# EAGLE design Input_Mode_Shield (EAGLE 5.06)
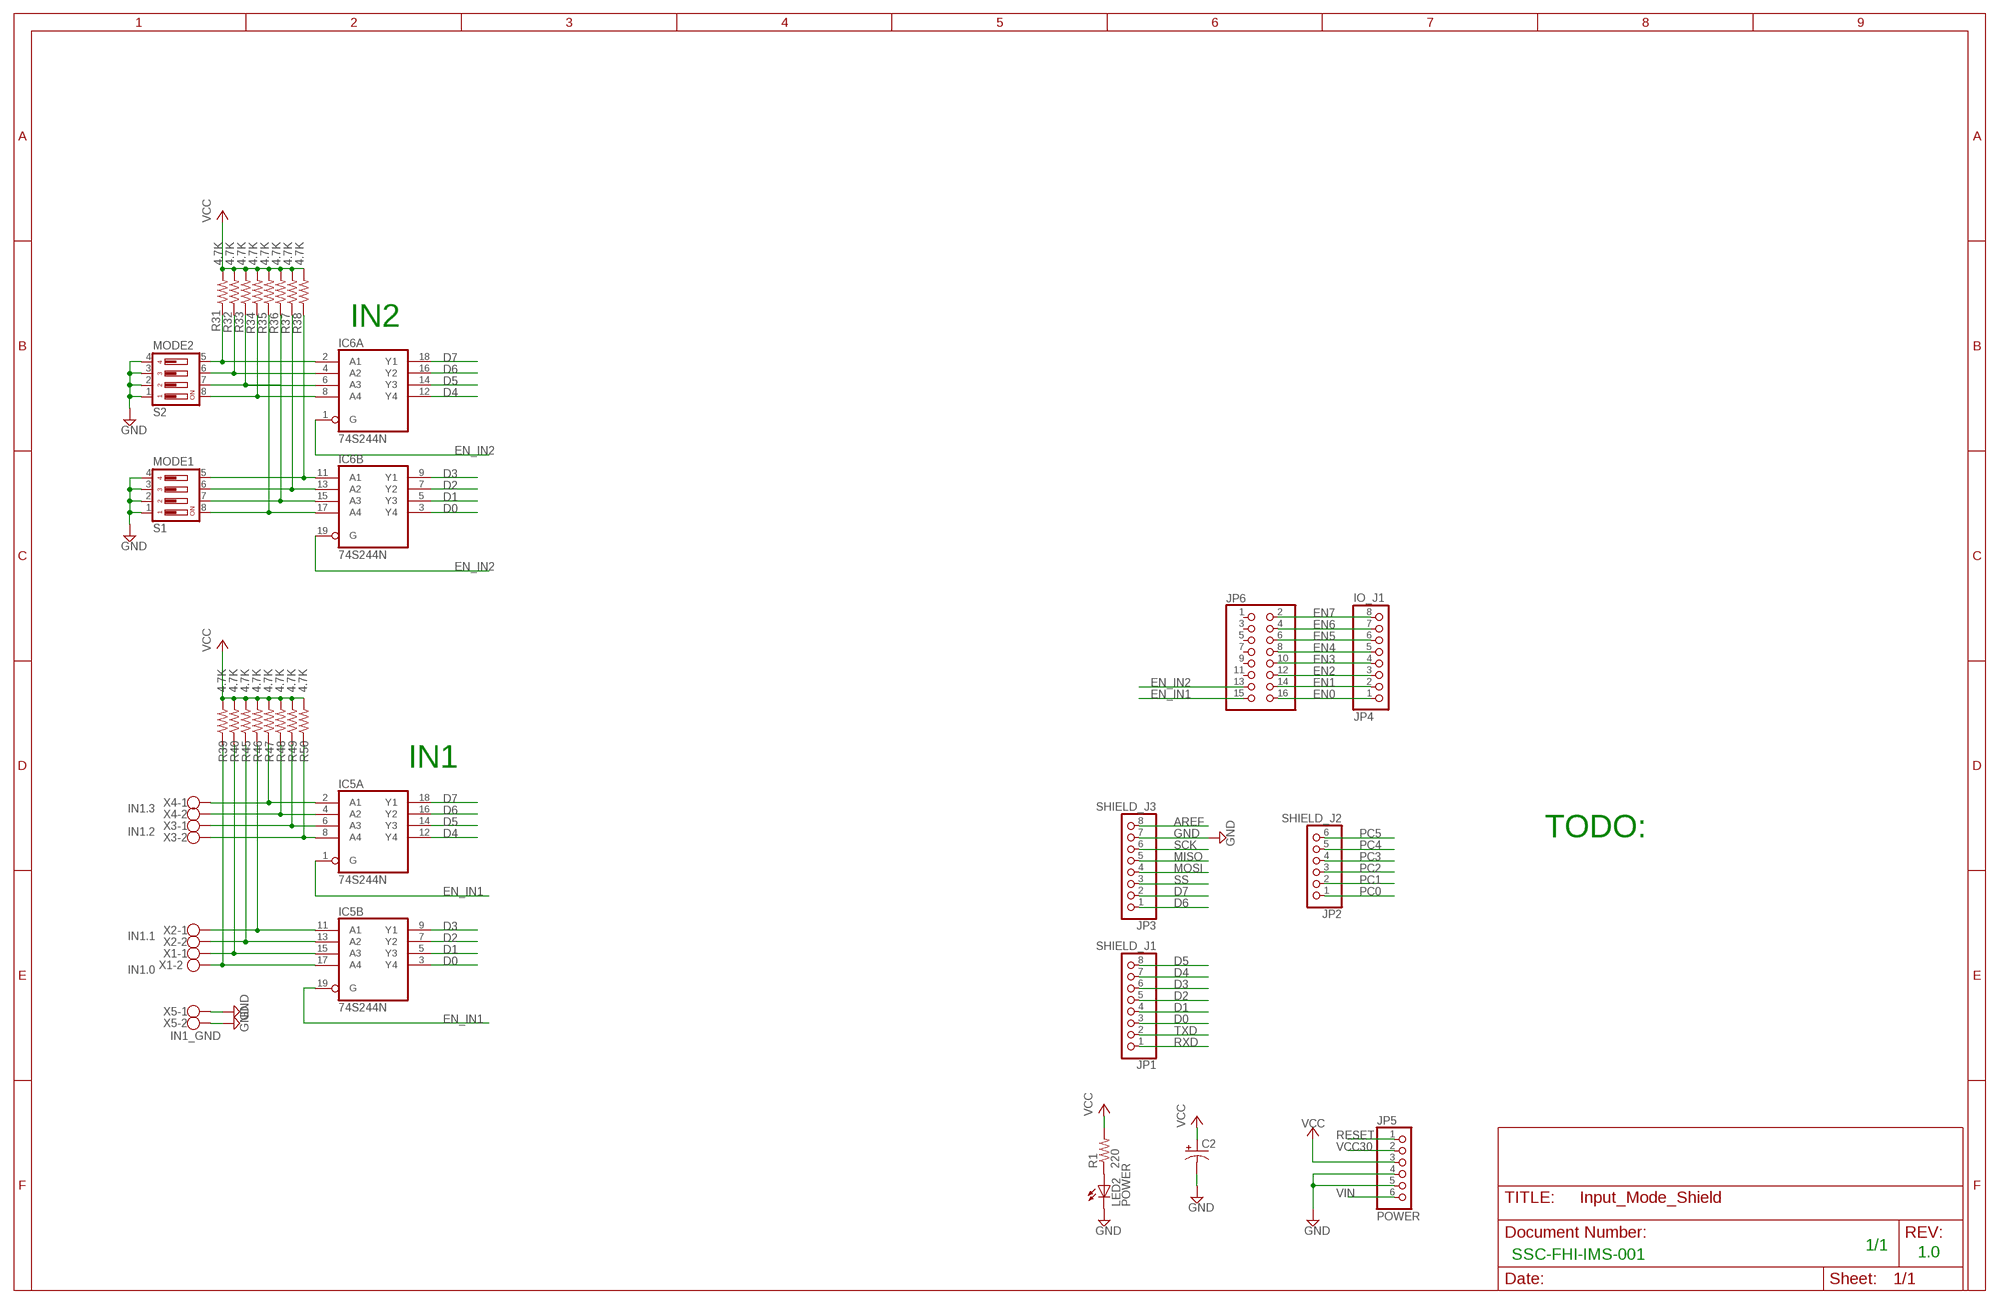
[diagram p0: schematic, sheet 1]

## Parts
C2  CPOL-USE2.5-5  [E2,5-5]
IC5  74S244N  [DIL20]
IC6  74S244N  [DIL20]
JP1  SHIELD_J1  PINHD-1X8  [1X08]
JP2  SHIELD_J2  PINHD-1X6  [1X06]
JP3  SHIELD_J3  PINHD-1X8  [1X08]
JP4  IO_J1  PINHD-1X8  [1X08]
JP5  POWER  PINHD-1X6  [1X06]
JP6  PINHD-2X8  [2X08]
LED2  POWER  LED5MM  [LED5MM]
R1  220  R-US_0204/7  [0204/7]
R31  4.7K  R-US_0207/2V  [0207/2V]
R32  4.7K  R-US_0207/2V  [0207/2V]
R33  4.7K  R-US_0207/2V  [0207/2V]
R34  4.7K  R-US_0207/2V  [0207/2V]
R35  4.7K  R-US_0207/2V  [0207/2V]
R36  4.7K  R-US_0207/2V  [0207/2V]
R37  4.7K  R-US_0207/2V  [0207/2V]
R38  4.7K  R-US_0207/2V  [0207/2V]
R39  4.7K  R-US_0207/2V  [0207/2V]
R40  4.7K  R-US_0207/2V  [0207/2V]
R45  4.7K  R-US_0207/2V  [0207/2V]
R46  4.7K  R-US_0207/2V  [0207/2V]
R47  4.7K  R-US_0207/2V  [0207/2V]
R48  4.7K  R-US_0207/2V  [0207/2V]
R49  4.7K  R-US_0207/2V  [0207/2V]
R50  4.7K  R-US_0207/2V  [0207/2V]
S1  MODE1  DS04  [DS-04]
S2  MODE2  DS04  [DS-04]
X1  IN1.0  AK550/2  [AK550/2]
X2  IN1.1  AK550/2  [AK550/2]
X3  IN1.2  AK550/2  [AK550/2]
X4  IN1.3  AK550/2  [AK550/2]
X5  IN1_GND  AK550/2  [AK550/2]

## Nets
AREF: JP3.8
D0: IC5.3(B:Y4) IC6.3(B:Y4) JP1.3
D1: IC5.5(B:Y3) IC6.5(B:Y3) JP1.4
D2: IC5.7(B:Y2) IC6.7(B:Y2) JP1.5
D3: IC5.9(B:Y1) IC6.9(B:Y1) JP1.6
D4: IC5.12(A:Y4) IC6.12(A:Y4) JP1.7
D5: IC5.14(A:Y3) IC6.14(A:Y3) JP1.8
D6: IC5.16(A:Y2) IC6.16(A:Y2) JP3.1
D7: IC5.18(A:Y1) IC6.18(A:Y1) JP3.2
EN0: JP4.1 JP6.16
EN1: JP4.2 JP6.14
EN2: JP4.3 JP6.12
EN3: JP4.4 JP6.10
EN4: JP4.5 JP6.8
EN5: JP4.6 JP6.6
EN6: JP4.7 JP6.4
EN7: JP4.8 JP6.2
EN_IN1: IC5.1(A:G) IC5.19(B:G) JP6.15
EN_IN2: IC6.1(A:G) IC6.19(B:G) JP6.13
GND: C2.- JP3.7 JP5.4 JP5.5 LED2.K(C) S1.1 S1.2 S1.3 S1.4 S2.1 S2.2 S2.3 S2.4 X5.1 X5.2
IN1: IC5.17(B:A4) R39.1 X1.2
IN2: IC5.15(B:A3) R40.1 X1.1
IN3: IC5.13(B:A2) R45.1 X2.2
IN4: IC5.11(B:A1) R46.1 X2.1
IN5: IC5.8(A:A4) R50.1 X3.2
IN6: IC5.6(A:A3) R49.1 X3.1
IN7: IC5.4(A:A2) R48.1 X4.2
IN8: IC5.2(A:A1) R47.1 X4.1
IN9: IC6.17(B:A4) R35.1 S1.8
IN10: IC6.15(B:A3) R36.1 S1.7
IN11: IC6.13(B:A2) R37.1 S1.6
IN12: IC6.11(B:A1) R38.1 S1.5
IN13: IC6.8(A:A4) R34.1 S2.8
IN14: IC6.6(A:A3) R33.1 S2.7
IN15: IC6.4(A:A2) R32.1 S2.6
IN16: IC6.2(A:A1) R31.1 S2.5
MISO: JP3.5
MOSI: JP3.4
N$1: LED2.A R1.1
PC0: JP2.1
PC1: JP2.2
PC2: JP2.3
PC3: JP2.4
PC4: JP2.5
PC5: JP2.6
RESET: JP5.1
RXD: JP1.1
SCK: JP3.6
SS: JP3.3
TXD: JP1.2
VCC: C2.+ JP5.3 R1.2 R31.2 R32.2 R33.2 R34.2 R35.2 R36.2 R37.2 R38.2 R39.2 R40.2 R45.2 R46.2 R47.2 R48.2 R49.2 R50.2
VCC30: JP5.2
VIN: JP5.6
Unconnected: JP6.1 JP6.3 JP6.5 JP6.7 JP6.9 JP6.11

## Notes on the sheet
- IN2
- IN1
- TODO:
- 1/1
- SSC-FHI-IMS-001 | 1.0

## Power pins joined to a net without a drawn wire
GND: IC5.10(P:GND) IC6.10(P:GND)
VCC: IC5.20(P:VCC) IC6.20(P:VCC)

## Library data of the parts
C2 = rcl:CPOL-US: POLARIZED CAPACITOR, American symbol
IC5 IC6 = 74xx-us:74*244: Octal BUFFER and LINE DRIVER, 3-state
JP1 JP3 JP4 = pinhead:PINHD-1X8: PIN HEADER
JP2 JP5 = pinhead:PINHD-1X6: PIN HEADER
JP6 = pinhead:PINHD-2X8: PIN HEADER
LED2 = led:LED: LED OSRAM: - CHIPLED LG R971, LG N971, LY N971, LG Q971, LY Q971, LO R971, LY R971 LH N974, LH R974 LS Q976, LO Q976, LY Q976 LO Q996 - Hyper CHIPLED LW Q18S LB Q993, LB Q99A, LB R99A - SideLED LS A670, LO A670, LY A670, LG A670, LP A670 LB A673, LV A673, LT A673, LW A673 LH A674 LY A675 LS A676, LA A676, LO A676, LY A676, LW A676 LS A679, LY A679, LG A679 - Hyper Micro SIDELED® LS Y876, LA Y876, LO Y876, LY Y876 LT Y87S - SmartLED LW L88C, LW L88S LB L89C, LB L89S, LG L890 LS L89K, LO L89K, LY L89K LS L896, LA L896, LO L896, LY L896 - TOPLED LS T670, LO T670, LY T670, LG T670, LP T670 LSG T670, LSP T670, LSY T670, LOP T670, LYG T670 LG T671, LOG T671, LSG T671 LB T673, LV T673, LT T673, LW T673 LH T674 LS T676, LA T676, LO T676, LY T676, LB T676, LH T676, LSB T676, LW T676 LB T67C, LV T67C, LT T67C, LS T67K, LO T67K, LY T67K, LW E67C LS E67B, LA E67B, LO E67B, LY E67B, LB E67C, LV E67C, LT E67C LW T67C LS T679, LY T679, LG T679 LS T770, LO T770, LY T770, LG T770, LP T770 LB T773, LV T773, LT T773, LW T773 LH T774 LS E675, LA E675, LY E675, LS T675 LS T776, LA T776, LO T776, LY T776, LB T776 LHGB T686 LT T68C, LB T68C - Hyper Mini TOPLED® LB M676 - Mini TOPLED Santana® LG M470 LS M47K, LO M47K, LY M47K Source: http://www.osram.convergy.de - LUMILED® LXK2-PW12-R00, LXK2-PW12-S00, LXK2-PW14-U00, LXK2-PW14-V00 LXK2-PM12-R00, LXK2-PM12-S00, LXK2-PM14-U00 LXK2-PE12-Q00, LXK2-PE12-R00, LXK2-PE12-S00, LXK2-PE14-T00, LXK2-PE14-U00 LXK2-PB12-K00, LXK2-PB12-L00, LXK2-PB12-M00, LXK2-PB14-N00, LXK2-PB14-P00, LXK2-PB14-Q00 LXK2-PR12-L00, LXK2-PR12-M00, LXK2-PR14-Q00, LXK2-PR14-R00 LXK2-PD12-Q00, LXK2-PD12-R00, LXK2-PD12-S00 LXK2-PH12-R00, LXK2-PH12-S00 LXK2-PL12-P00, LXK2-PL12-Q00, LXK2-PL12-R00 Source: www.luxeon.com
R1 R31-R40 R45-R50 = resistor:R-US_: RESISTOR, American symbol
S1 S2 = switch-dil:DS04: DIL/CODE SWITCH
X1-X5 = con-ptr500+_v5:AK550/2: CONNECTOR

## Board
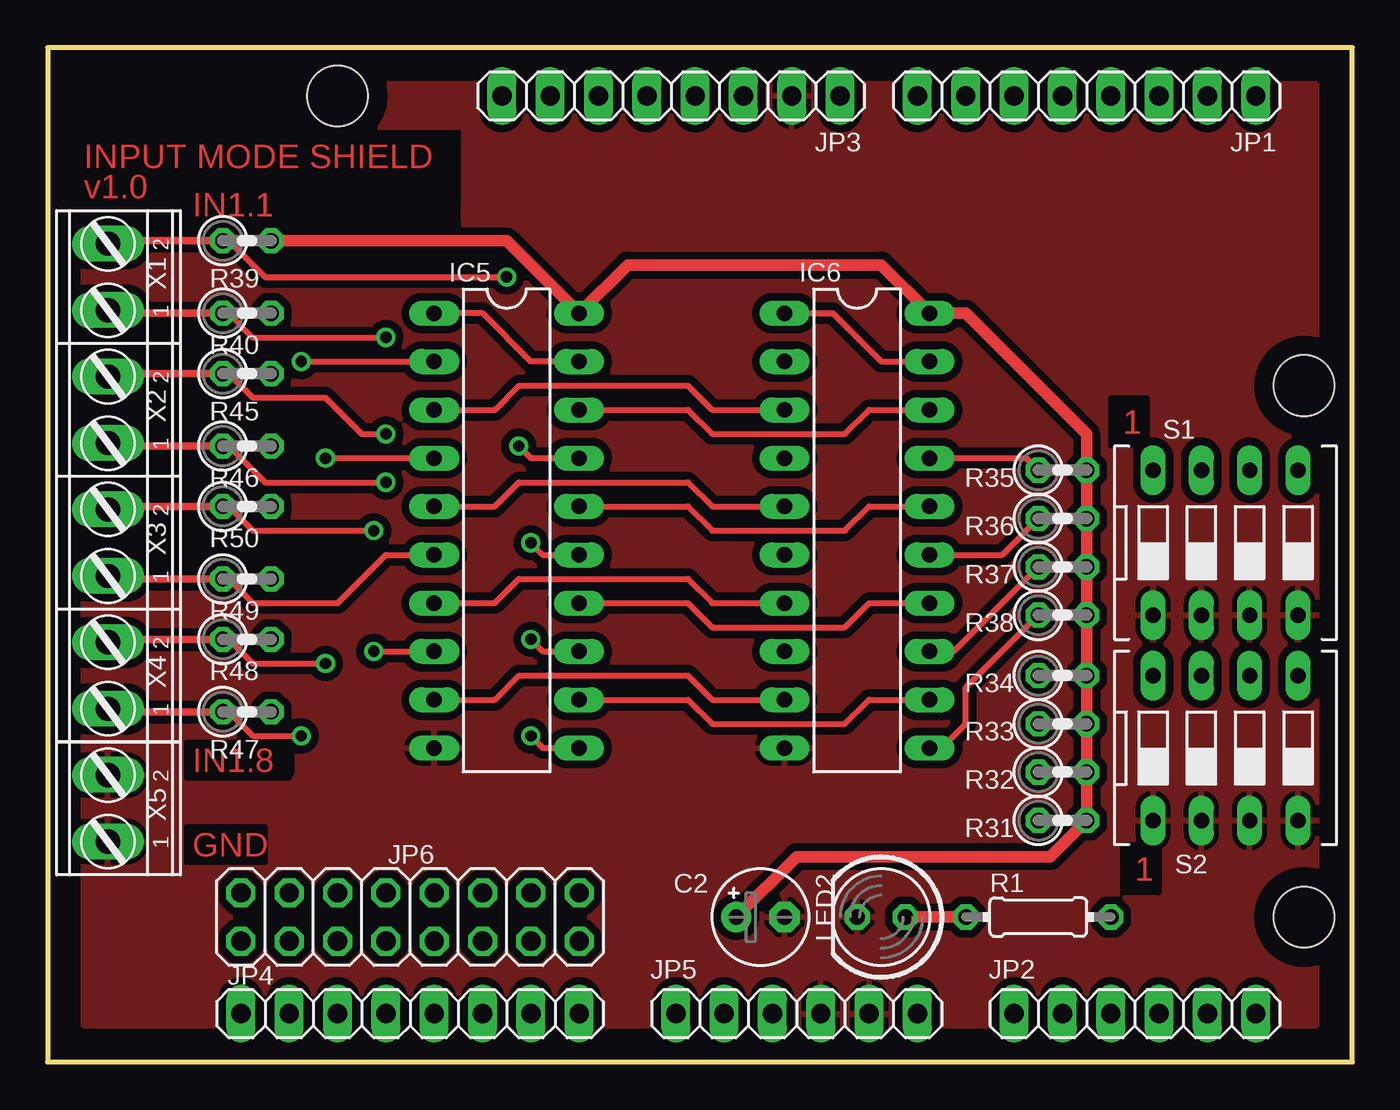
[diagram p1: board, top side]
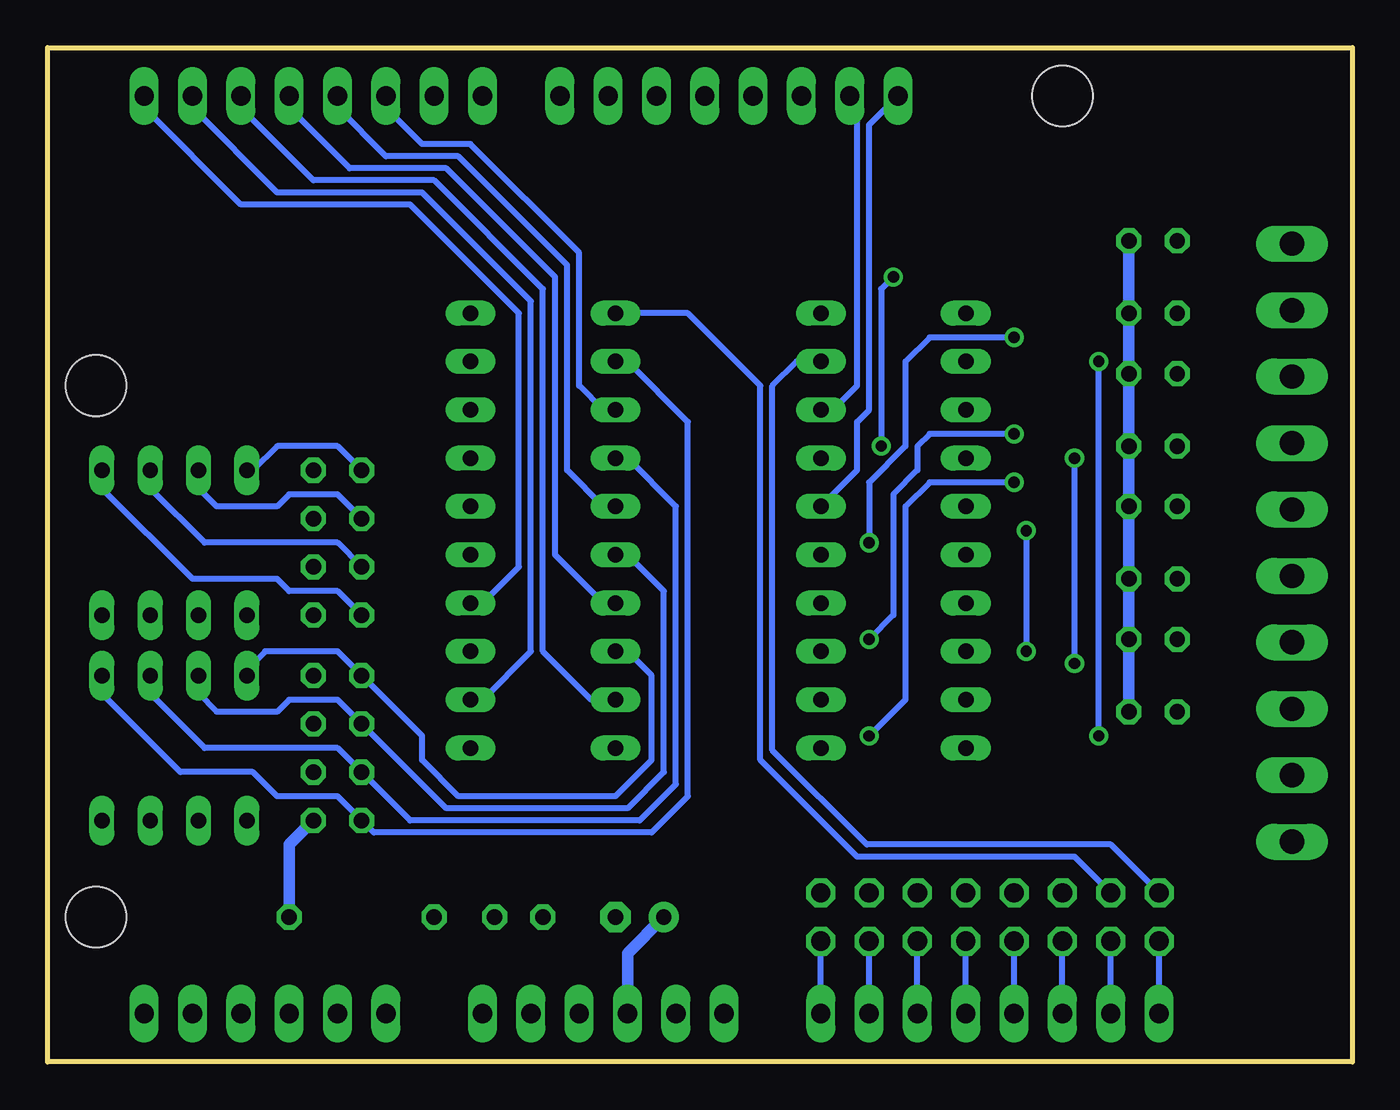
[diagram p2: board, bottom side, seen from below]

Size 68.58 x 53.34 mm. Coordinates in mm from the lower left corner, seen from the top.
Outline: 0,0 68.58,0 68.58,53.34 0,53.34 0,0
Copper layers (1*16): Top 0.035mm / dielectric 1.5mm / Bottom 0.035mm
Design rules "default *": minimum track width 8mil, minimum drill 20mil, track to track 16mil, track to pad 16mil, pad to pad 8mil, via to via 8mil, smd to smd 8mil, copper to edge 40mil, drill to drill 8mil, minimum pad ring 10mil, minimum via ring 8mil, stop-mask expansion 4mil, vias tented up to drill 0mil, thermal gap 10mil
Holes 3.2 mm at 15.24,50.8 66.04,35.56 66.04,7.62
tRestrict: area 1.3,45.1 to 21.6,48.9; area 55.9,32.4 to 57.8,34.9; area 56.5,8.9 to 58.4,11.4; area 7.3,14.9 to 12.7,16.8; area 7.3,10.5 to 11.4,12.4; area 7,44.1 to 21.6,46

### Footprints (pad centres in the part's own frame; a part is rotated, then mirrored left to right if it is on the bottom)
E2,5-5 = drill 0.813 pad 1.6 round: + -1.27,0 | drill 0.813 pad 1.6 octagon: - 1.27,0
DIL20 = drill 0.813 long: 1 -11.43,-3.81; 2 -8.89,-3.81; 3 -6.35,-3.81; 4 -3.81,-3.81; 5 -1.27,-3.81; 6 1.27,-3.81; 7 3.81,-3.81; 8 6.35,-3.81; 9 8.89,-3.81; 10 11.43,-3.81; 11 11.43,3.81; 12 8.89,3.81; 13 6.35,3.81; 14 3.81,3.81; 15 1.27,3.81; 16 -1.27,3.81; 17 -3.81,3.81; 18 -6.35,3.81; 19 -8.89,3.81; 20 -11.43,3.81
1X08 = drill 1.016 long: 1 -8.89,0; 2 -6.35,0; 3 -3.81,0; 4 -1.27,0; 5 1.27,0; 6 3.81,0; 7 6.35,0; 8 8.89,0
1X06 = drill 1.016 long: 1 -6.35,0; 2 -3.81,0; 3 -1.27,0; 4 1.27,0; 5 3.81,0; 6 6.35,0
2X08 = drill 1.016 octagon: 1 -8.89,-1.27; 2 -8.89,1.27; 3 -6.35,-1.27; 4 -6.35,1.27; 5 -3.81,-1.27; 6 -3.81,1.27; 7 -1.27,-1.27; 8 -1.27,1.27; 9 1.27,-1.27; 10 1.27,1.27; 11 3.81,-1.27; 12 3.81,1.27; 13 6.35,-1.27; 14 6.35,1.27; 15 8.89,-1.27; 16 8.89,1.27
LED5MM = drill 0.813 octagon: A -1.27,0; K 1.27,0
0204/7 = drill 0.813 octagon: 1 -3.81,0; 2 3.81,0
0207/2V = drill 0.813 octagon: 1 -1.27,0; 2 1.27,0
DS-04 = drill 0.813 long: 1 -3.81,-3.81; 2 -1.27,-3.81; 3 1.27,-3.81; 4 3.81,-3.81; 5 3.81,3.81; 6 1.27,3.81; 7 -1.27,3.81; 8 -3.81,3.81
AK550/2 = drill 1.27 long: 1 -1.75,0; 2 1.75,0

### Placement (x,y rotation side)
C2  37.47,7.62 0 top
IC5  24.13,27.94 270 top
IC6  42.55,27.94 270 top
JP1  54.61,50.8 0 top
JP2  57.15,2.54 0 top
JP3  32.77,50.8 0 top
JP4  19.05,2.54 0 top
JP5  39.37,2.54 0 top
JP6  19.05,7.62 180 top
LED2  43.81,7.62 180 top
R1  52.07,7.62 0 top
R31  53.34,12.7 0 top
R32  53.34,15.24 0 top
R33  53.34,17.78 0 top
R34  53.34,20.32 0 top
R35  53.34,31.11 0 top
R36  53.34,28.57 0 top
R37  53.34,26.04 0 top
R38  53.34,23.5 0 top
R39  10.48,43.18 0 top
R40  10.48,39.37 0 top
R45  10.48,36.2 0 top
R46  10.48,32.38 0 top
R47  10.48,18.41 0 top
R48  10.48,22.23 0 top
R49  10.48,25.4 0 top
R50  10.48,29.21 0 top
S1  61.91,27.3 0 top
S2  61.91,16.51 0 top
X1  3.17,41.27 90 top
X2  3.17,34.29 90 top
X3  3.17,27.3 90 top
X4  3.17,20.32 90 top
X5  3.17,13.34 90 top

### Tracks (layer width: path | path; a pad name or v marks a point on that pad's centre or on a via)
D0
  Top 0.305: IC5.3 23.5,34.29 24.77,35.56 33.66,35.56 34.92,34.29 IC6.3
  Bottom 0.305: IC6.3 39.37,34.29 40.64,35.56 40.64,42.55 46.35,48.26 48.9,48.26 50.8,50.16 JP1.3
D1
  Top 0.305: IC5.5 23.5,29.21 24.77,30.48 33.66,30.48 34.92,29.21 IC6.5
  Bottom 0.305: IC6.5 39.37,29.21 41.27,31.11 41.27,41.91 46.99,47.62 50.8,47.62 53.34,50.16 JP1.4
D2
  Top 0.305: IC5.7 23.5,24.13 24.77,25.4 33.66,25.4 34.92,24.13 IC6.7
  Bottom 0.305: IC6.7 39.37,24.13 41.91,26.67 41.91,41.27 47.62,46.99 52.7,46.99 55.88,50.16 JP1.5
D3
  Top 0.305: IC5.9 23.5,19.05 24.77,20.32 33.66,20.32 34.92,19.05 IC6.9
  Bottom 0.305: IC6.9 40.01,19.05 42.55,21.59 42.55,40.64 48.26,46.35 54.61,46.35 58.42,50.16 JP1.6
D4
  Top 0.305: IC5.12 33.66,19.05 34.92,17.78 41.91,17.78 43.18,19.05 IC6.12
  Bottom 0.305: IC6.12 45.72,19.05 43.18,21.59 43.18,40.01 48.9,45.72 56.52,45.72 60.96,50.16 JP1.7
D5
  Top 0.305: IC5.14 33.66,24.13 34.92,22.86 41.91,22.86 43.18,24.13 IC6.14
  Bottom 0.305: IC6.14 45.72,24.13 43.81,26.04 43.81,39.37 49.53,45.09 58.42,45.09 63.5,50.16 JP1.8
D6
  Top 0.305: IC6.16 43.18,29.21 41.91,27.94 34.92,27.94 33.66,29.21 IC5.16
  Bottom 0.305: JP3.1 25.4,49.28 25.4,34.29 26.04,33.66 26.04,31.11 IC5.16
D7
  Top 0.305: IC6.18 43.18,34.29 41.91,33.02 34.92,33.02 33.66,34.29 IC5.18
  Bottom 0.305: IC5.18 27.3,34.29 26.04,35.56 26.04,50.42 JP3.2
EN0
  Bottom 0.305: JP4.1 JP6.16
EN1
  Bottom 0.305: JP4.2 JP6.14
EN2
  Bottom 0.305: JP4.3 JP6.12
EN3
  Bottom 0.305: JP4.4 JP6.10
EN4
  Bottom 0.305: JP4.5 JP6.8
EN5
  Bottom 0.305: JP4.6 JP6.6
EN6
  Bottom 0.305: JP4.7 JP6.4
EN7
  Bottom 0.305: JP4.8 JP6.2
EN_IN1
  Top 0.305: IC5.19 25.4,36.83 22.86,39.37 IC5.1
  Bottom 0.305: IC5.19 29.21,36.83 30.48,35.56 30.48,16.39 25.52,11.43 12.7,11.43 JP6.15
EN_IN2
  Top 0.305: IC6.19 43.81,36.83 41.27,39.37 IC6.1
  Bottom 0.305: IC6.1 34.92,39.37 31.11,35.56 31.11,15.88 26.04,10.79 14.61,10.79 JP6.13
GND
  pour Top: 1.91,51.44 66.67,51.44 66.67,49.53 66.67,19.05 66.67,1.91 1.91,1.91 1.91,5.08
IN1  (via drill 0.6)
  Top 0.305: IC5.17 25.4,31.75 v24.77,32.38 | R39.1 9.53,43.18 11.43,41.27 v24.13,41.27
  Top 0.406: R39.1 3.33,43.18 X1.2
  Bottom 0.305: v24.13,41.27 24.77,40.64 v24.77,32.38
IN2  (via drill 0.6)
  Top 0.305: IC5.15 26.04,26.67 v25.4,27.3 | R40.1 9.53,39.37 10.79,38.1 v17.78,38.1
  Top 0.406: R40.1 3.33,39.37 X1.1
  Bottom 0.305: v17.78,38.1 22.23,38.1 23.5,36.83 23.5,32.38 25.4,30.48 v25.4,27.3
IN3  (via drill 0.6)
  Top 0.305: IC5.13 26.04,21.59 v25.4,22.23 | R45.1 9.53,36.2 10.79,34.92 14.61,34.92 16.51,33.02 v17.78,33.02
  Top 0.406: R45.1 3.33,36.2 X2.2
  Bottom 0.305: v17.78,33.02 22.23,33.02 22.86,32.38 22.86,31.11 24.13,29.84 24.13,23.5 v25.4,22.23
IN4  (via drill 0.6)
  Top 0.305: IC5.11 26.04,16.51 v25.4,17.14 | R46.1 9.53,32.38 11.43,30.48 v17.78,30.48
  Top 0.406: R46.1 3.33,32.38 X2.1
  Bottom 0.305: v17.78,30.48 22.23,30.48 23.5,29.21 23.5,19.05 v25.4,17.14
IN5  (via drill 0.6)
  Top 0.305: R50.1 9.53,29.21 10.79,27.94 v17.14,27.94 | v17.14,21.59 IC5.8
  Top 0.406: R50.1 3.33,29.21 X3.2
  Bottom 0.305: v17.14,27.94 v17.14,21.59
IN6
  Top 0.305: R49.1 9.53,25.4 10.79,24.13 15.24,24.13 17.78,26.67 IC5.6
  Top 0.406: R49.1 3.33,25.4 X3.1
IN7  (via drill 0.6)
  Top 0.305: R48.1 9.53,22.23 10.79,20.95 v14.61,20.95 | v14.61,31.75 IC5.4
  Top 0.406: R48.1 3.33,22.23 X4.2
  Bottom 0.305: v14.61,20.95 v14.61,31.75
IN8  (via drill 0.6)
  Top 0.305: R47.1 9.53,18.41 10.79,17.14 v13.34,17.14 | v13.34,36.83 IC5.2
  Top 0.406: R47.1 3.33,18.41 X4.1
  Bottom 0.305: v13.34,17.14 v13.34,36.83
IN9
  Top 0.305: IC6.17 51.44,31.75 R35.1
  Bottom 0.305: S1.8 57.78,31.11 56.52,32.38 53.34,32.38 R35.1
IN10
  Top 0.305: IC6.15 50.16,26.67 R36.1
  Bottom 0.305: S1.7 60.64,30.16 59.69,29.21 56.52,29.21 55.88,29.84 53.34,29.84 R36.1
IN11
  Top 0.305: IC6.13 47.62,21.59 R37.1
  Bottom 0.305: S1.6 63.18,30.16 60.33,27.3 53.34,27.3 R37.1
IN12
  Top 0.305: R38.1 48.26,19.68 48.26,17.78 46.99,16.51 IC6.11
  Bottom 0.305: S1.5 65.72,30.16 60.96,25.4 56.52,25.4 55.88,24.77 53.34,24.77 R38.1
IN13
  Bottom 0.305: IC6.8 38.1,21.59 36.83,20.32 36.83,15.88 38.73,13.97 46.99,13.97 48.9,15.88 48.9,17.14 R34.1 53.34,21.59 57.15,21.59 58.1,20.64 S2.8
IN14
  Bottom 0.305: IC6.6 38.1,26.67 36.2,24.77 36.2,15.24 38.1,13.34 47.62,13.34 R33.1 53.34,19.05 55.88,19.05 56.52,18.41 59.69,18.41 60.64,19.37 S2.7
IN15
  Bottom 0.305: IC6.4 38.1,31.75 35.56,29.21 35.56,14.61 37.47,12.7 49.53,12.7 R32.1 53.34,16.51 60.33,16.51 63.18,19.37 S2.6
IN16
  Bottom 0.305: IC6.2 38.1,36.83 34.92,33.66 34.92,13.97 36.83,12.06 51.44,12.06 R31.1 53.34,13.97 56.52,13.97 57.78,15.24 61.59,15.24 65.72,19.37 S2.5
N$1
  Top 0.61: LED2.A R1.1
VCC
  Top 0.61: R39.2 24.13,43.18 IC5.20 30.48,41.91 43.81,41.91 IC6.20 48.26,39.37 54.61,33.02 R35.2 R36.2 R37.2 R38.2 R34.2 R33.2 R32.2 R31.2 52.7,10.79 39.37,10.79 C2.+
  Bottom 0.61: R47.2 R48.2 R49.2 R50.2 R46.2 R45.2 R40.2 R39.2 | JP5.3 38.1,5.71 C2.+ | R1.2 55.88,11.43 R31.2

### Text on the board
Top: INPUT MODE SHIELD | v1.0 | IN1.1 | 1 | IN1.8 | GND | 1